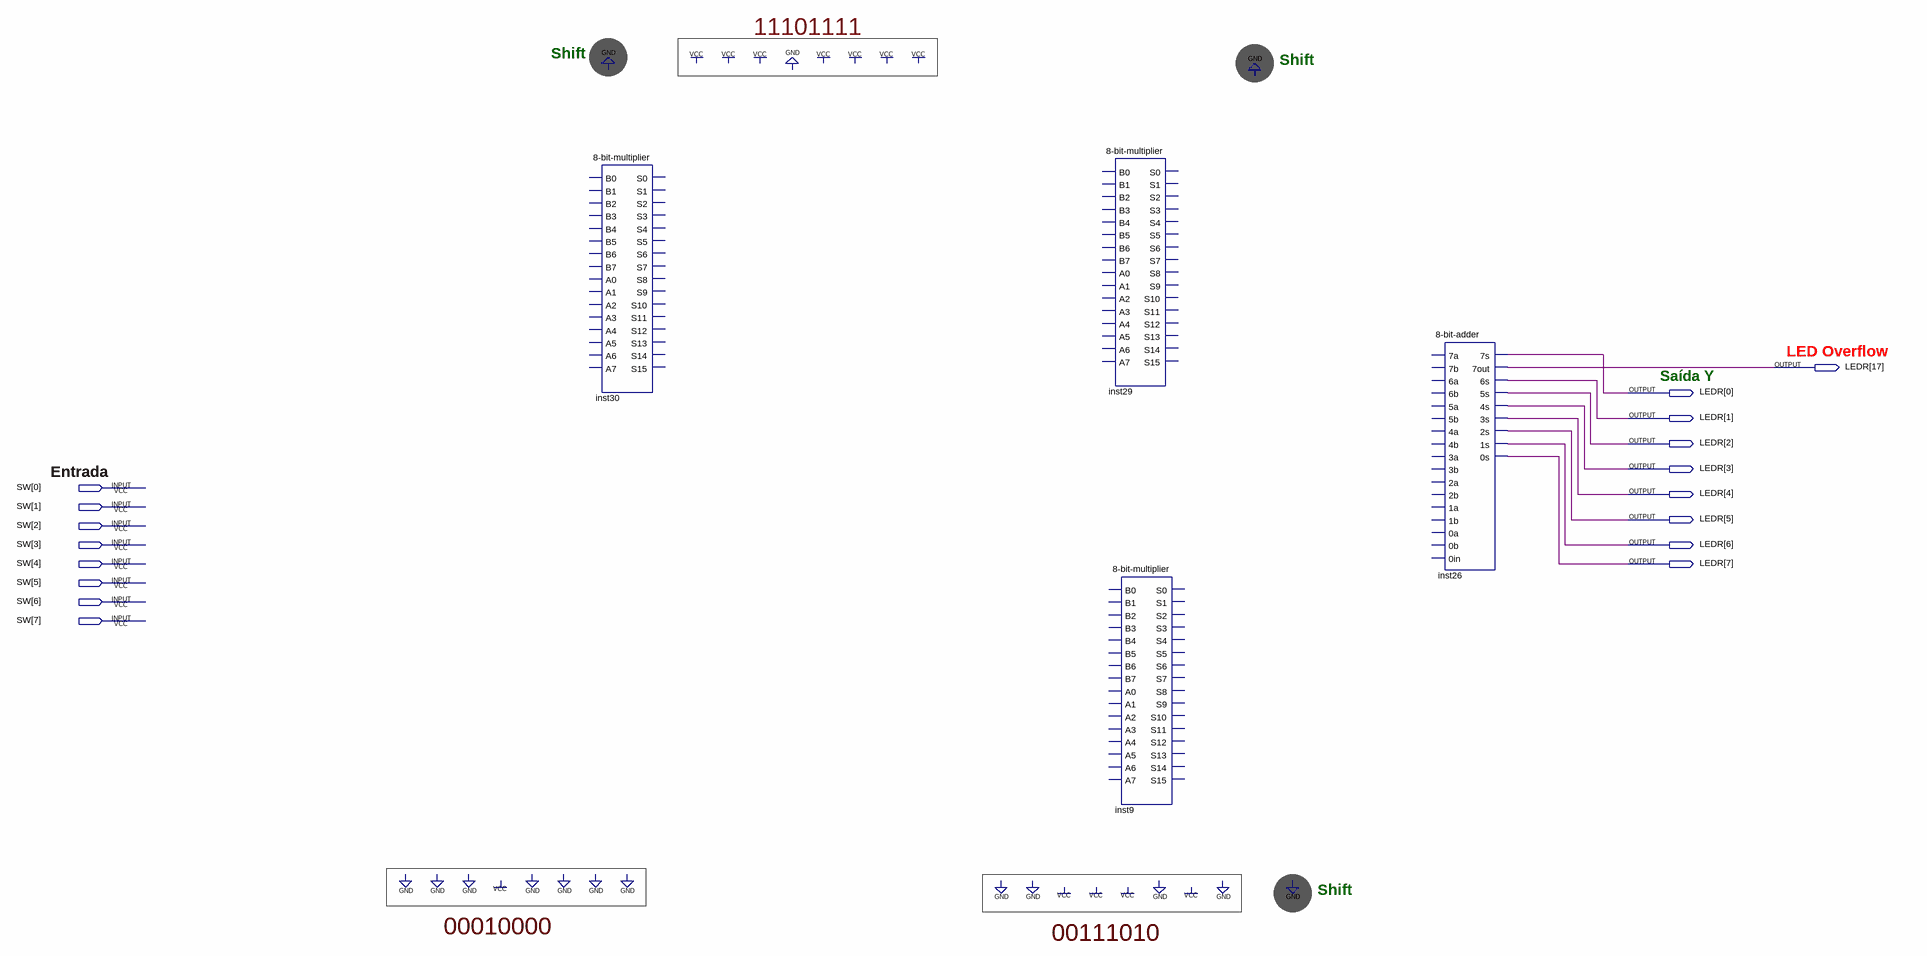
[diagram p0: schematic sheet]
// Quartus schematic circuit.bdf as structural Verilog: 4 symbols, 17 pins
module circuit (
  input  [7:0] SW,
  output [17:0] LEDR
);

  \8-bit-multiplier  inst30 ();  // open: B0, B1, B2, B3, B4, B5, B6, B7, A0, A1, A2, A3, A4, A5, A6, A7, S0, S1, S2, S3, S4, S5, S6, S7, S8, S9, S10, S11, S12, S13, S14, S15
  \8-bit-multiplier  inst29 ();  // open: B0, B1, B2, B3, B4, B5, B6, B7, A0, A1, A2, A3, A4, A5, A6, A7, S0, S1, S2, S3, S4, S5, S6, S7, S8, S9, S10, S11, S12, S13, S14, S15
  \8-bit-multiplier  inst9 ();  // open: B0, B1, B2, B3, B4, B5, B6, B7, A0, A1, A2, A3, A4, A5, A6, A7, S0, S1, S2, S3, S4, S5, S6, S7, S8, S9, S10, S11, S12, S13, S14, S15
  \8-bit-adder  inst26 (
    .\7s (LEDR[0]), .\7out (LEDR[17]), .\6s (LEDR[1]), .\5s (LEDR[2]), .\4s (LEDR[3]), .\3s (LEDR[4]),
    .\2s (LEDR[5]), .\1s (LEDR[6]), .\0s (LEDR[7]));  // open: 7a, 7b, 6a, 6b, 5a, 5b, 4a, 4b, 3a, 3b, 2a, 2b, 1a, 1b, 0a, 0b, 0in

  // Notes on the sheet:
  //   11101111
  //   Shift
  //   Shift
  //   LED Overflow
  //   Saída Y
  //   Entrada
  //   Shift
  //   00010000
  //   00111010
endmodule
